# EAGLE design M3-Module1 (EAGLE 7.2.0)
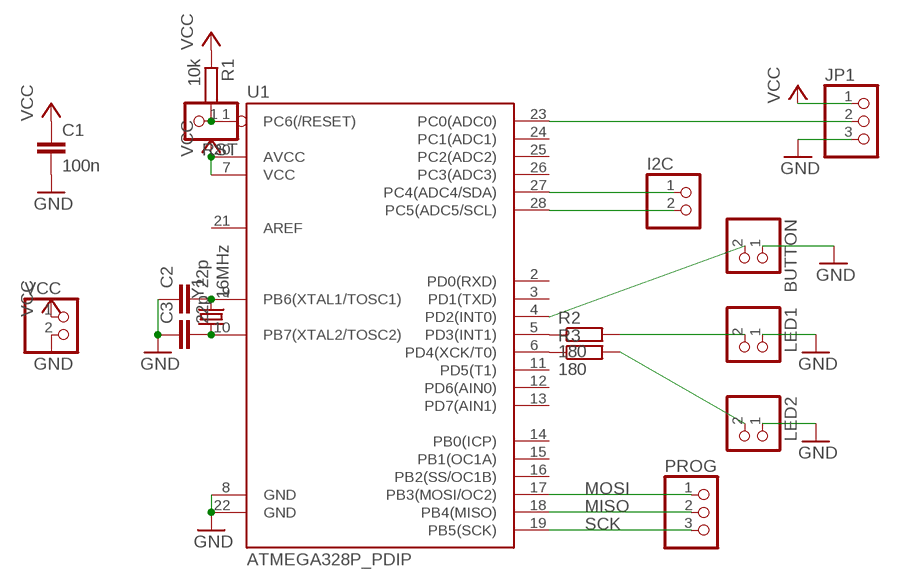
[diagram p0: schematic, sheet 1]

## Parts
BUTTON  PINHD-1X2  [1X02]
C1  100n  C-EU025-025X050  [C025-025X050]
C2  22p  C-EU025-025X050  [C025-025X050]
C3  22p  C-EU025-025X050  [C025-025X050]
I2C  PINHD-1X2  [1X02]
JP1  PINHD-1X3  [1X03]
LED1  PINHD-1X2  [1X02]
LED2  PINHD-1X2  [1X02]
PROG  PINHD-1X3  [1X03]
R1  10k  R-EU_0204/5  [0204/5]
R2  180  R-EU_0204/5  [0204/5]
R3  180  R-EU_0204/5  [0204/5]
RST  PINHD-1X1  [1X01]
U1  ATMEGA328P_PDIP  [DIL28-3]
VCC  PINHD-1X2  [1X02]
Y1  16MHz  CRYSTALHC49US  [HC49US]

## Nets
GND: BUTTON.1 C1.2 C2.1 C3.1 JP1.3 LED1.1 LED2.1 U1.8(GND) U1.22(GND) VCC.2
MISO: PROG.2 U1.18(PB4(MISO))
MOSI: PROG.1 U1.17(PB3(MOSI/OC2))
N$1: R1.2 RST.1 U1.1(PC6(/RESET))
N$2: I2C.1 U1.27(PC4(ADC4/SDA))
N$3: I2C.2 U1.28(PC5(ADC5/SCL))
N$4: C2.2 U1.9(PB6(XTAL1/TOSC1)) Y1.2
N$5: C3.2 U1.10(PB7(XTAL2/TOSC2)) Y1.1
N$6: BUTTON.2 U1.4(PD2(INT0))
N$7: R2.1 U1.5(PD3(INT1))
N$8: R3.1 U1.6(PD4(XCK/T0))
N$9: LED1.2 R2.2
N$10: LED2.2 R3.2
N$11: JP1.2 U1.23(PC0(ADC0))
SCK: PROG.3 U1.19(PB5(SCK))
VCC: C1.1 JP1.1 R1.1 U1.7(VCC) U1.20(AVCC) VCC.1
Unconnected: U1.2(PD0(RXD)) U1.3(PD1(TXD)) U1.11(PD5(T1)) U1.12(PD6(AIN0)) U1.13(PD7(AIN1)) U1.14(PB0(ICP)) U1.15(PB1(OC1A)) U1.16(PB2(SS/OC1B)) U1.21(AREF) U1.24(PC1(ADC1)) U1.25(PC2(ADC2)) U1.26(PC3(ADC3))

## Library data of the parts
BUTTON I2C LED1 LED2 VCC = pinhead:PINHD-1X2: PIN HEADER
C1-C3 = resistor:C-EU: CAPACITOR, European symbol
JP1 PROG = pinhead:PINHD-1X3: PIN HEADER
R1-R3 = rcl:R-EU_: RESISTOR, European symbol
RST = pinhead:PINHD-1X1: PIN HEADER
U1 = SparkFun-DigitalIC:ATMEGA328P_PDIP: uC used in the Arduino 32kb flash, 1k EEPROM, 2k SRAM This is the through-hole version of this chip.
Y1 = SteveMarple:CRYSTAL: Crystals Various standard crystals. Proven footprints. Spark Fun Electronics SKU : COM-00534

## Board
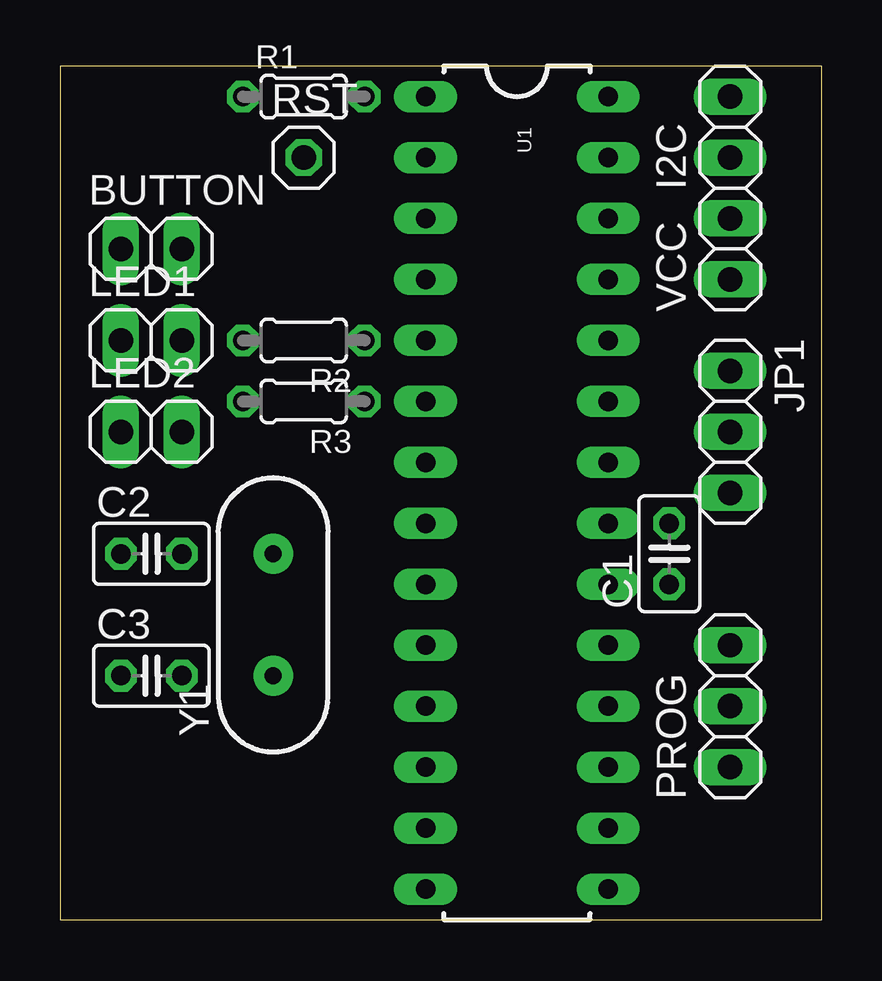
[diagram p1: board, top side]
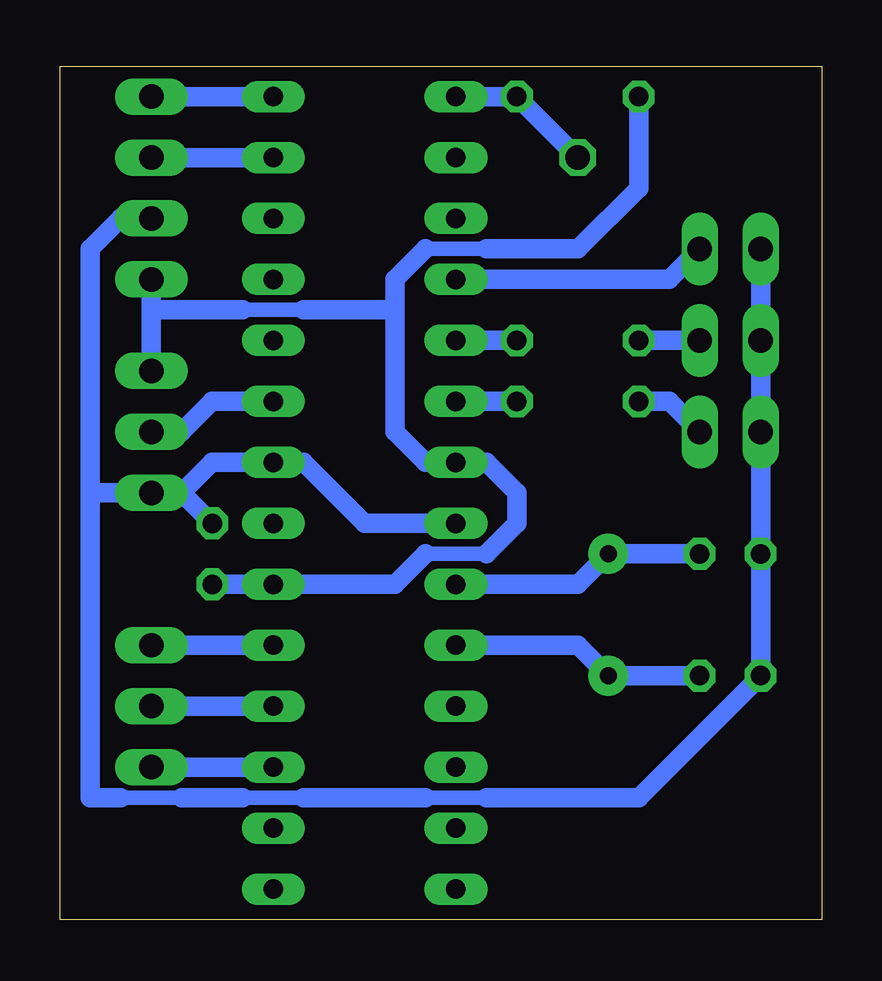
[diagram p2: board, bottom side, seen from below]

Size 31.75 x 35.56 mm. Coordinates in mm from the lower left corner, seen from the top.
Outline: 0,0 31.75,0 31.75,35.56 0,35.56 0,0
Copper layers (1*16): Top 0.035mm / dielectric 1.5mm / Bottom 0.035mm
Design rules "default": minimum track width 10mil, minimum drill 24mil, track to track 8mil, track to pad 8mil, pad to pad 8mil, via to via 8mil, smd to smd 8mil, copper to edge 40mil, drill to drill 8mil, minimum pad ring 10mil, minimum via ring 8mil, stop-mask expansion 4mil, vias tented up to drill 0mil, thermal gap 10mil

### Footprints (pad centres in the part's own frame; a part is rotated, then mirrored left to right if it is on the bottom)
1X02 = drill 1.016 long: 1 -1.27,0; 2 1.27,0
C025-025X050 = drill 0.813 octagon: 1 -1.27,0; 2 1.27,0
1X03 = drill 1.016 long: 1 -2.54,0; 2 0,0; 3 2.54,0
0204/5 = drill 0.813 octagon: 1 -2.54,0; 2 2.54,0
1X01 = drill 1.016 octagon: 1 0,0
DIL28-3 = drill 0.813 long: 1 -16.51,-3.81; 2 -13.97,-3.81; 3 -11.43,-3.81; 4 -8.89,-3.81; 5 -6.35,-3.81; 6 -3.81,-3.81; 7 -1.27,-3.81; 8 1.27,-3.81; 9 3.81,-3.81; 10 6.35,-3.81; 11 8.89,-3.81; 12 11.43,-3.81; 13 13.97,-3.81; 14 16.51,-3.81; 15 16.51,3.81; 16 13.97,3.81; 17 11.43,3.81; 18 8.89,3.81; 19 6.35,3.81; 20 3.81,3.81; 21 1.27,3.81; 22 -1.27,3.81; 23 -3.81,3.81; 24 -6.35,3.81; 25 -8.89,3.81; 26 -11.43,3.81; 27 -13.97,3.81; 28 -16.51,3.81
HC49US = drill 0.7 pad 1.651: 1 -2.54,0; 2 2.54,0

### Placement (x,y rotation side)
BUTTON  3.81,27.94 0 top
C1  25.4,15.24 90 top
C2  3.81,15.24 0 top
C3  3.81,10.16 0 top
I2C  27.94,33.02 90 top
JP1  27.94,20.32 270 top
LED1  3.81,24.13 0 top
LED2  3.81,20.32 0 top
PROG  27.94,8.89 90 top
R1  10.16,34.29 0 top
R2  10.16,24.13 180 top
R3  10.16,21.59 180 top
RST  10.16,31.75 0 top
U1  19.05,17.78 270 top
VCC  27.94,27.94 90 top
Y1  8.89,12.7 90 top

### Tracks (layer width: path | path; a pad name or v marks a point on that pad's centre or on a via)
GND
  Bottom 0.61: 13.97,5.08 16.51,5.08 | 21.59,5.08 24.13,5.08 | 26.67,5.08 29.21,5.08
  Bottom 0.813: BUTTON.1 LED1.1 LED2.1 C2.1 C3.1 7.62,5.08 13.97,5.08 | 26.67,17.78 JP1.3 30.48,17.78 | 26.67,17.78 25.4,19.05 U1.22 21.59,19.05 19.05,16.51 U1.8 | VCC.2 29.21,29.21 30.48,27.94 30.48,17.78 | C1.2 26.67,17.78 | 16.51,5.08 21.59,5.08 | 24.13,5.08 26.67,5.08 | 29.21,5.08 30.48,5.08 30.48,17.78
MISO
  Bottom 0.813: PROG.2 U1.18
MOSI
  Bottom 0.813: PROG.1 U1.17
N$1
  Bottom 0.813: U1.1 R1.2 RST.1
N$2
  Bottom 0.813: U1.27 I2C.1
N$3
  Bottom 0.813: U1.28 I2C.2
N$4
  Bottom 0.813: U1.9 10.16,13.97 Y1.2 C2.2
N$5
  Bottom 0.813: U1.10 10.16,11.43 Y1.1 C3.2
N$6
  Bottom 0.813: U1.4 6.35,26.67 BUTTON.2
N$7
  Bottom 0.813: U1.5 R2.1
N$8
  Bottom 0.813: U1.6 R3.1
N$9
  Bottom 0.813: R2.2 LED1.2
N$10
  Bottom 0.813: R3.2 6.35,21.59 LED2.2
N$11
  Bottom 0.813: U1.23 25.4,21.59 26.67,20.32 JP1.2
SCK
  Bottom 0.813: PROG.3 U1.19
VCC
  Bottom 0.61: 16.51,15.24 13.97,15.24 | 13.97,27.94 16.51,27.94 | 24.13,25.4 21.59,25.4
  Bottom 0.813: 16.51,15.24 17.78,13.97 U1.20 C1.1 | 13.97,15.24 12.7,16.51 12.7,17.78 13.97,19.05 U1.7 16.51,19.05 17.78,20.32 17.78,25.4 | R1.1 7.62,30.48 10.16,27.94 13.97,27.94 | 16.51,27.94 17.78,26.67 17.78,25.4 | VCC.1 27.94,25.4 | JP1.1 27.94,25.4 | 27.94,25.4 24.13,25.4 | 21.59,25.4 17.78,25.4